# EAGLE design ws2812_Pentagon_V01 (EAGLE 7.7.0)
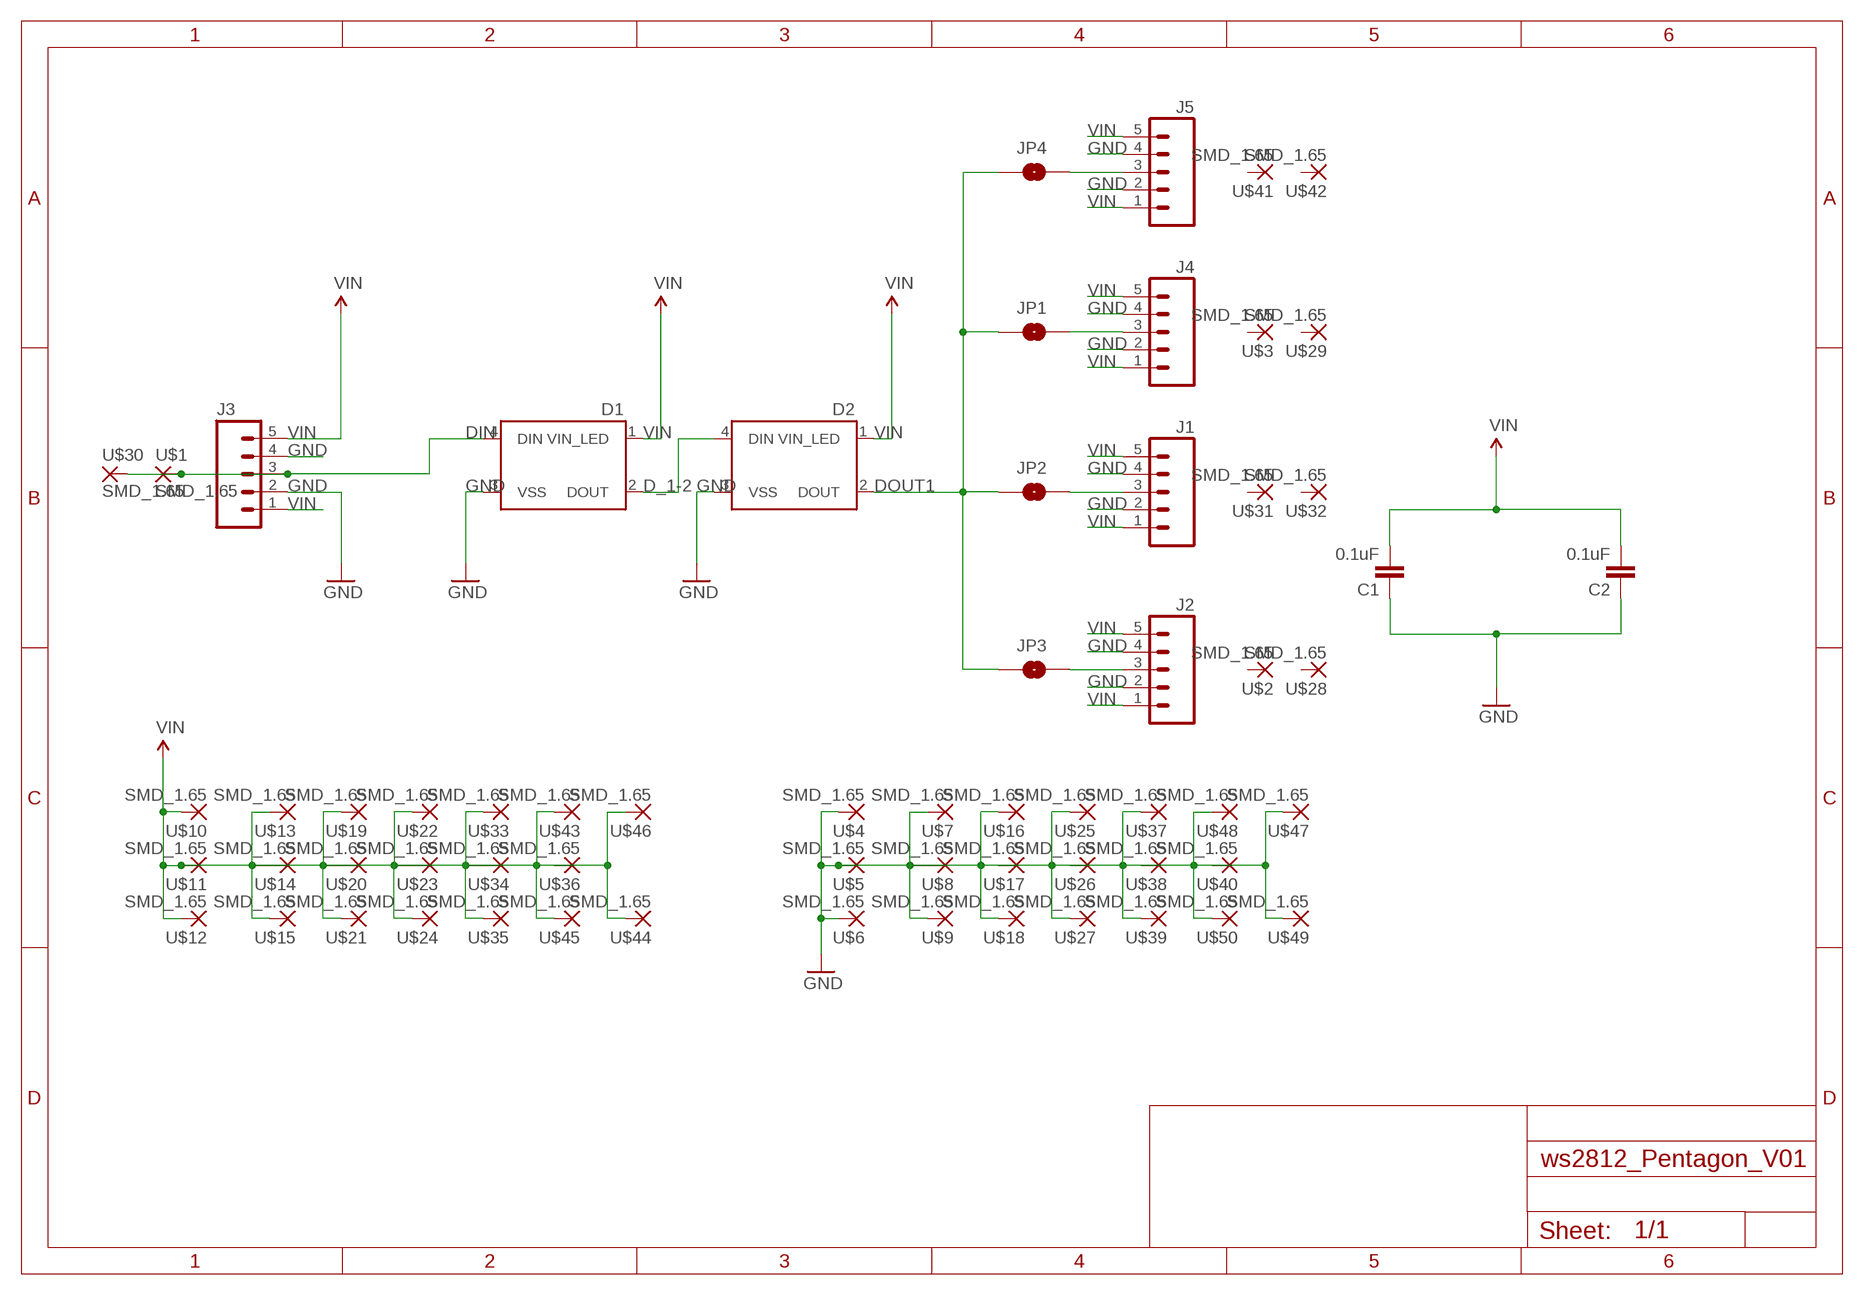
[diagram p0: schematic, sheet 1]

## Parts
C1  0.1uF  CAP0805  [0805]
C2  0.1uF  CAP0805  [0805]
D1  WS2812B  [WS2812B]
D2  WS2812B  [WS2812B]
J1  M05NO_SILK  [1X05_NO_SILK]
J2  M05NO_SILK  [1X05_NO_SILK]
J3  M05NO_SILK  [1X05_NO_SILK]
J4  M05NO_SILK  [1X05_NO_SILK]
J5  M05NO_SILK  [1X05_NO_SILK]
JP1  JUMPER-PAD-2-NOYES_SILK  [PAD-JUMPER-2-NO_YES_SILK]
JP2  JUMPER-PAD-2-NOYES_SILK  [PAD-JUMPER-2-NO_YES_SILK]
JP3  JUMPER-PAD-2-NOYES_SILK  [PAD-JUMPER-2-NO_YES_SILK]
JP4  JUMPER-PAD-2-NOYES_SILK  [PAD-JUMPER-2-NO_YES_SILK]
U$1  SMD_1.65  [SMD_PTH_1.65]
U$2  SMD_1.65  [SMD_PTH_1.65]
U$3  SMD_1.65  [SMD_PTH_1.65]
U$4  SMD_1.65  [SMD_PTH_1.65]
U$5  SMD_1.65  [SMD_PTH_1.65]
U$6  SMD_1.65  [SMD_PTH_1.65]
U$7  SMD_1.65  [SMD_PTH_1.65]
U$8  SMD_1.65  [SMD_PTH_1.65]
U$9  SMD_1.65  [SMD_PTH_1.65]
U$10  SMD_1.65  [SMD_PTH_1.65]
U$11  SMD_1.65  [SMD_PTH_1.65]
U$12  SMD_1.65  [SMD_PTH_1.65]
U$13  SMD_1.65  [SMD_PTH_1.65]
U$14  SMD_1.65  [SMD_PTH_1.65]
U$15  SMD_1.65  [SMD_PTH_1.65]
U$16  SMD_1.65  [SMD_PTH_1.65]
U$17  SMD_1.65  [SMD_PTH_1.65]
U$18  SMD_1.65  [SMD_PTH_1.65]
U$19  SMD_1.65  [SMD_PTH_1.65]
U$20  SMD_1.65  [SMD_PTH_1.65]
U$21  SMD_1.65  [SMD_PTH_1.65]
U$22  SMD_1.65  [SMD_PTH_1.65]
U$23  SMD_1.65  [SMD_PTH_1.65]
U$24  SMD_1.65  [SMD_PTH_1.65]
U$25  SMD_1.65  [SMD_PTH_1.65]
U$26  SMD_1.65  [SMD_PTH_1.65]
U$27  SMD_1.65  [SMD_PTH_1.65]
U$28  SMD_1.65  [SMD_PTH_1.65]
U$29  SMD_1.65  [SMD_PTH_1.65]
U$30  SMD_1.65  [SMD_PTH_1.65]
U$31  SMD_1.65  [SMD_PTH_1.65]
U$32  SMD_1.65  [SMD_PTH_1.65]
U$33  SMD_1.65  [SMD_PTH_1.65]
U$34  SMD_1.65  [SMD_PTH_1.65]
U$35  SMD_1.65  [SMD_PTH_1.65]
U$36  SMD_1.65  [SMD_PTH_1.65]
U$37  SMD_1.65  [SMD_PTH_1.65]
U$38  SMD_1.65  [SMD_PTH_1.65]
U$39  SMD_1.65  [SMD_PTH_1.65]
U$40  SMD_1.65  [SMD_PTH_1.65]
U$41  SMD_1.65  [SMD_PTH_1.65]
U$42  SMD_1.65  [SMD_PTH_1.65]
U$43  SMD_1.65  [SMD_PTH_1.65]
U$44  SMD_1.65  [SMD_PTH_1.65]
U$45  SMD_1.65  [SMD_PTH_1.65]
U$46  SMD_1.65  [SMD_PTH_1.65]
U$47  SMD_1.65  [SMD_PTH_1.65]
U$48  SMD_1.65  [SMD_PTH_1.65]
U$49  SMD_1.65  [SMD_PTH_1.65]
U$50  SMD_1.65  [SMD_PTH_1.65]

## Nets
D_1-2: D1.2(DOUT) D2.4(DIN)
DIN: D1.4(DIN) J3.3 U$1.P$1(P) U$30.P$1(P)
DOUT1: D2.2(DOUT) JP1.1 JP2.1 JP3.1 JP4.1
GND: C1.1 C2.1 D1.3(VSS) D2.3(VSS) J1.2 J1.4 J2.2 J2.4 J3.2 J3.4 J4.2 J4.4 J5.2 J5.4 U$4.P$1(P) U$5.P$1(P) U$6.P$1(P) U$7.P$1(P) U$8.P$1(P) U$9.P$1(P) U$16.P$1(P) U$17.P$1(P) U$18.P$1(P) U$25.P$1(P) U$26.P$1(P) U$27.P$1(P) U$37.P$1(P) U$38.P$1(P) U$39.P$1(P) U$40.P$1(P) U$47.P$1(P) U$48.P$1(P) U$49.P$1(P) U$50.P$1(P)
N$1: J4.3 JP1.2
N$2: J2.3 JP3.2
N$3: J1.3 JP2.2
N$4: J5.3 JP4.2
VIN: C1.2 C2.2 D1.1(VIN_LED) D2.1(VIN_LED) J1.1 J1.5 J2.1 J2.5 J3.1 J3.5 J4.1 J4.5 J5.1 J5.5 U$10.P$1(P) U$11.P$1(P) U$12.P$1(P) U$13.P$1(P) U$14.P$1(P) U$15.P$1(P) U$19.P$1(P) U$20.P$1(P) U$21.P$1(P) U$22.P$1(P) U$23.P$1(P) U$24.P$1(P) U$33.P$1(P) U$34.P$1(P) U$35.P$1(P) U$36.P$1(P) U$43.P$1(P) U$44.P$1(P) U$45.P$1(P) U$46.P$1(P)
Unconnected: U$2.P$1(P) U$3.P$1(P) U$28.P$1(P) U$29.P$1(P) U$31.P$1(P) U$32.P$1(P) U$41.P$1(P) U$42.P$1(P)

## Library data of the parts
C1 C2 = SparkFun-Capacitors:CAP: Capacitor Standard 0603 ceramic capacitor, and 0.1" leaded capacitor.
D1 D2 = SparkFun-LED:WS2812B: WS2812B - Intelligent control LED integrated light source Technical Specifications: Power Supply Voltage (VDD): 3.5 to 5.3 V Input Voltage (VI): -0.5 to VDD+0.5 V Operating Junction Temperature (Topt): -25°C to +80°C Storage Temperature Range (Tstg): -55°C to +150°C; PROD_ID: DIO-12503
J1-J5 = SparkFun-Connectors:M05: Header 5 Standard 5-pin 0.1" header. Use with straight break away headers (SKU : PRT-00116), right angle break away headers (PRT-00553), swiss pins (PRT-00743), machine pins (PRT-00117), and female headers (PRT-00115). Molex polarized connector foot print use with SKU : PRT-08230 with associated crimp pins and housings.
JP1-JP4 = SparkFun-Passives:JUMPER-PAD-2-NO
U$1-U$50 = Modified_wirepad:SMD_1.65

## Board
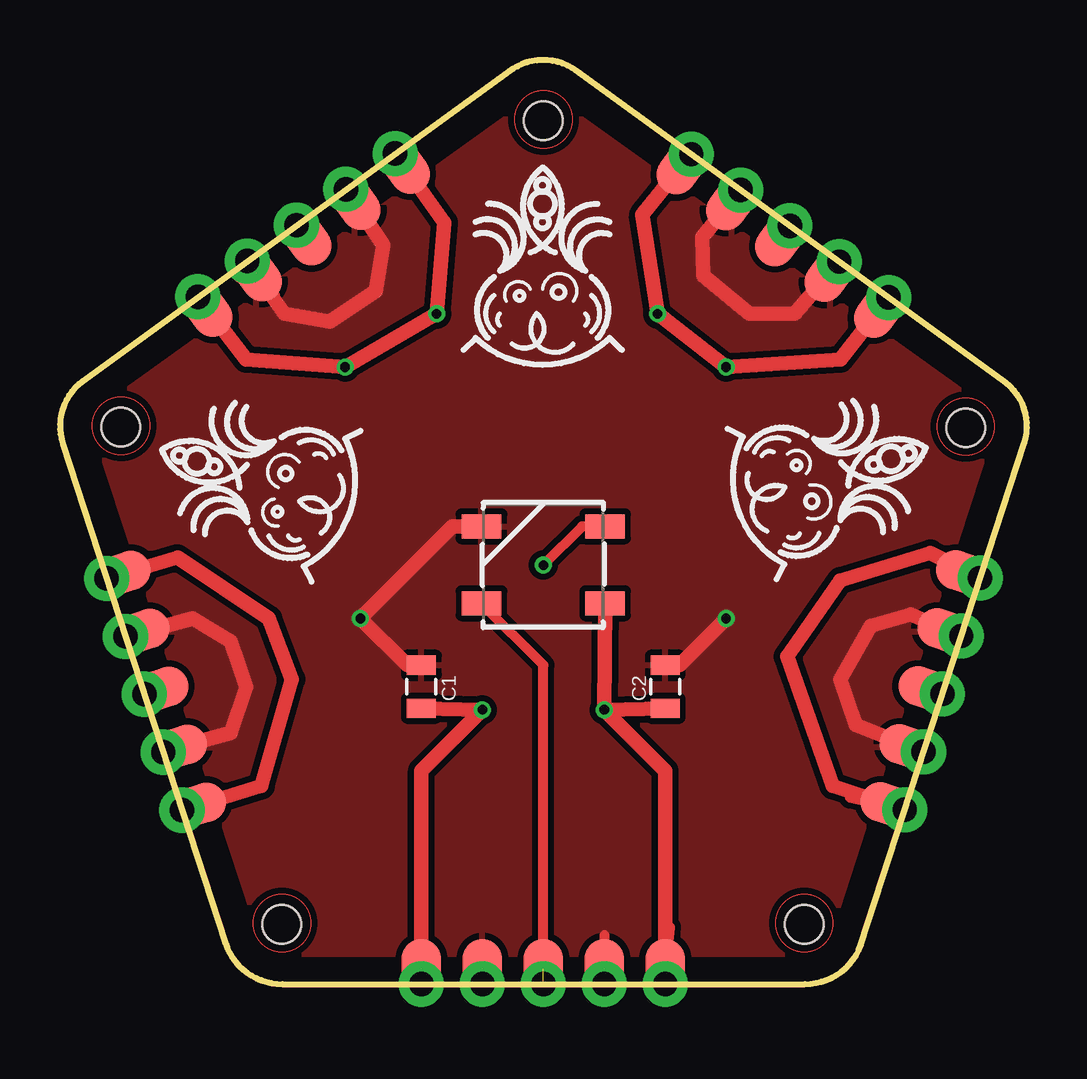
[diagram p1: board, top side]
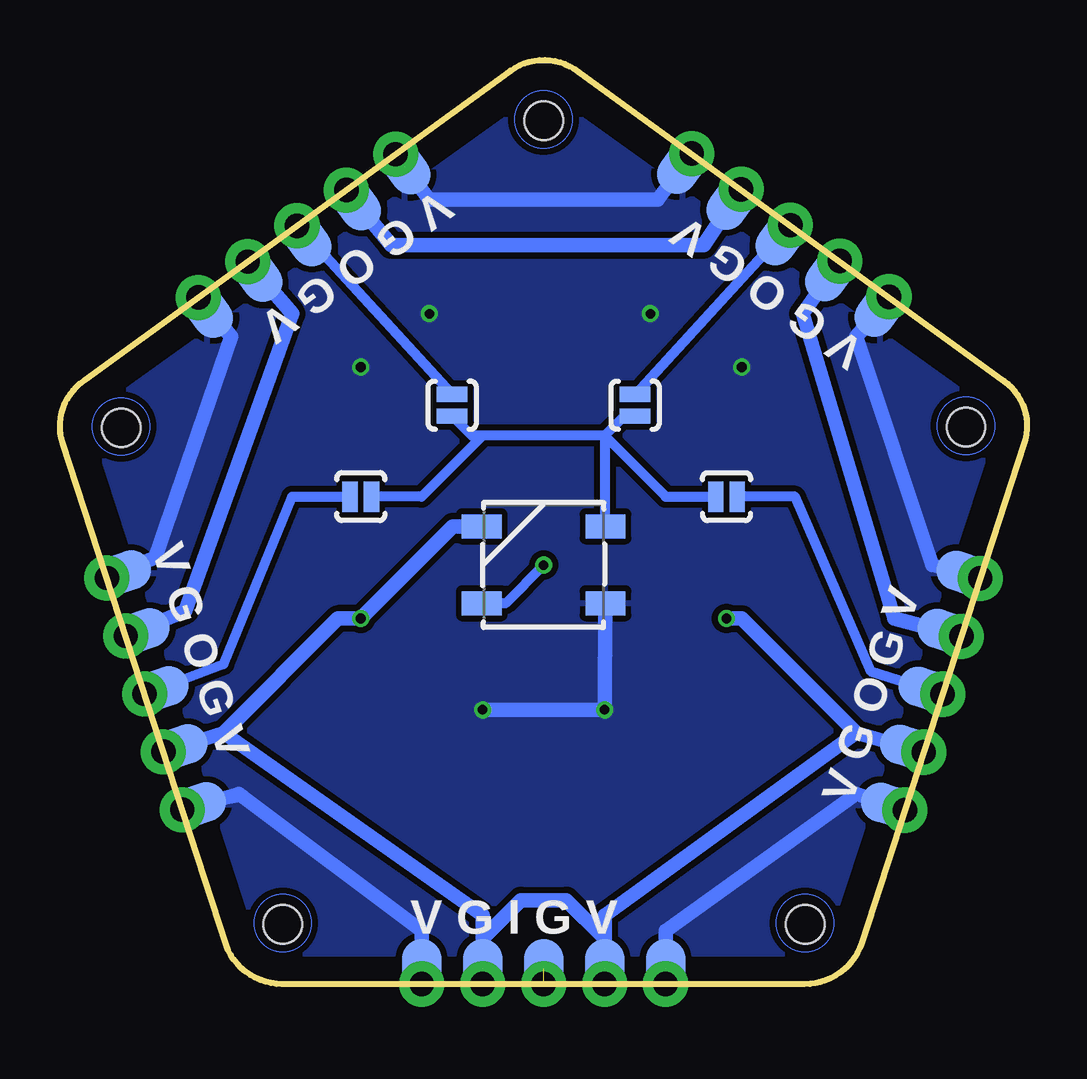
[diagram p2: board, bottom side, seen from below]

Size 40.29 x 38.52 mm. Coordinates in mm from the lower left corner, seen from the top.
Outline: 9.27,0 31.04,0 arc70 33.37,1.63 40.18,22.55 arc75 39.26,25.17 21.51,38.08 arc74 18.69,38.02 0.96,25.15 arc73 0.12,22.5 6.88,1.73 arc72 9.27,0
Copper layers (1*16): Top 0.035mm / dielectric 1.5mm / Bottom 0.035mm
Design rules "SeeedStudio_2layer_DRU_no_angle_20140221": minimum track width 6mil, minimum drill 12mil, track to track 6mil, track to pad 6mil, pad to pad 6mil, via to via 6mil, smd to smd 0mil, copper to edge 10mil, drill to drill 10mil, minimum pad ring 10mil, minimum via ring 6mil, stop-mask expansion 2mil, vias tented up to drill 100mil, thermal gap 10mil
Holes 1.6 mm at 9.24,2.49 31.01,2.49 37.74,23.19 2.54,23.22 20.14,35.99

### Footprints (pad centres in the part's own frame; a part is rotated, then mirrored left to right if it is on the bottom)
0805 = smd 0.8 x 1.2: 1 -0.9,0; 2 0.9,0
WS2812B = smd 1.651 x 1: 1 -2.577,1.6; 2 -2.577,-1.6; 3 2.577,-1.6; 4 2.577,1.6
1X05_NO_SILK = drill 1.016 pad 1.88: 1 0,0; 2 2.54,0; 3 5.08,0; 4 7.62,0; 5 10.16,0
PAD-JUMPER-2-NO_YES_SILK = smd 0.635 x 1.27: 1 -0.45,0; 2 0.45,0
SMD_PTH_1.65 = smd 1.65 x 2.5: P$1 0,0.635

### Placement (x,y rotation side)
C1  15.06,12.4 270 top
C2  25.22,12.4 270 top
D1  20.14,17.48 180 top
D2  20.14,17.48 180 bottom
J1  13.97,34.62 216 top
J2  1.95,16.91 288 top
J3  15.06,0 0 top
J4  35.2,7.26 72 top
J5  34.52,28.62 144 top
JP1  27.76,20.32 180 bottom
JP2  16.33,24.13 90 bottom
JP3  12.52,20.32 0 bottom
JP4  23.95,24.13 90 bottom
U$1  20.14,0 0 bottom
U$2  9.86,31.64 144 bottom
U$3  3.52,12.08 72 bottom
U$4  17.6,0 0 bottom
U$5  22.68,0 0 bottom
U$6  7.8,30.14 144 bottom
U$7  11.91,33.13 144 bottom
U$8  2.73,14.5 72 bottom
U$9  4.3,9.67 72 bottom
U$10  25.22,0 0 bottom
U$11  15.06,0 0 bottom
U$12  13.97,34.62 144 bottom
U$13  5.75,28.65 144 bottom
U$14  1.95,16.91 72 bottom
U$15  5.08,7.25 72 bottom
U$16  17.6,0 0 top
U$17  22.68,0 0 top
U$18  2.73,14.5 288 top
U$19  1.95,16.91 288 top
U$20  15.06,0 0 top
U$21  25.22,0 0 top
U$22  5.08,7.25 288 top
U$23  13.97,34.62 216 top
U$24  5.75,28.65 216 top
U$25  4.3,9.67 288 top
U$26  11.91,33.13 216 top
U$27  7.8,30.14 216 top
U$28  9.86,31.64 216 top
U$29  3.52,12.08 288 top
U$30  20.14,0 0 top
U$31  36.77,12.1 288 bottom
U$32  36.77,12.1 72 top
U$33  35.2,7.26 72 top
U$34  38.34,16.93 72 top
U$35  38.34,16.93 288 bottom
U$36  35.2,7.26 288 bottom
U$37  35.98,9.68 72 top
U$38  35.98,9.68 288 bottom
U$39  37.55,14.51 288 bottom
U$40  37.55,14.51 72 top
U$41  30.41,31.61 216 bottom
U$42  30.41,31.61 144 top
U$43  26.3,34.59 216 bottom
U$44  26.3,34.59 144 top
U$45  34.52,28.62 216 bottom
U$46  34.52,28.62 144 top
U$47  28.36,33.1 216 bottom
U$48  28.36,33.1 144 top
U$49  32.47,30.11 216 bottom
U$50  32.47,30.11 144 top

### Tracks (layer width: path | path; a pad name or v marks a point on that pad's centre or on a via)
D_1-2  (via drill 0.4)
  Top 0.406: D1.2 21.75,19.07 v20.14,17.46
  Bottom 0.406: v20.14,17.46 21.73,15.88 D2.4 | D2.4
DIN  (2 unrouted)
  Top 0.406: J3.3 20.14,13.3 D1.4
DOUT1
  Bottom 0.406: JP2.1 16.78,23.68 17.6,22.86 | 17.6,22.86 17.6,19.11 D2.2 | 17.6,22.86 15.06,20.32 JP3.1 | 17.6,22.86 22.68,22.86 | 22.68,22.86 23.13,22.86 JP4.1 | 22.68,22.86 25.22,20.32 JP1.1
GND  (via drill 0.4)  (5 unrouted)
  Top 0.406: U$17.P$1 J3.4 | U$17.P$1 22.68,1.78 | 22.68,2.03 U$17.P$1 | U$27.P$1 8.45,28.96 U$27.P$1 | U$27.P$1 7.95,29.97 | 7.95,29.97 7.95,30.23 8.96,28.7 7.69,30.23 | 7.69,30.23 8.71,28.7 7.95,29.97 | 7.95,29.97 7.69,30.23 | 7.69,30.23 7.69,29.97 7.44,29.46 U$27.P$1 | U$26.P$1 12.52,32 12.01,33.02 12.26,32
  Top 0.61: C1.1 14.46,13.29 v12.52,15.24 16.35,19.07 D1.3 | C2.1 25.81,13.29 v27.76,15.24 | U$25.P$1 7.12,10.48 7.76,12.38 7.12,14.29 5.53,15.24 J2.2 | J4.2 33.16,10.79 32.52,12.7 33.79,14.92 35.44,15.4 J4.4 | J5.2 30.62,27.94 28.71,27.94 26.81,29.53 26.77,31.14 J5.4 | J1.4 9.34,27.94 11.25,27.62 13.15,28.89 13.47,30.8 J1.2
  Bottom 0.406: U$47.P$1 27.46,32.59 27.46,31.99 | U$49.P$1 31.64,29.6 31.64,29.15 | U$40.P$1 | U$40.P$1 37.55,14.71 J4.4 | U$38.P$1 | U$38.P$1 J4.2
  Bottom 0.61: J3.2 17.6,1.91 | 17.6,1.91 17.6,2.86 7.12,10.48 | 7.12,10.48 J2.4 U$25.P$1 | 17.6,1.91 19.19,3.49 21.09,3.49 22.68,1.91 J3.4 22.68,2.86 33.47,10.48 | 33.47,10.48 J4.2 | J4.4 35.06,15.56 30.62,27.94 31.64,29.15 J5.2 | J5.4 27.46,31.99 26.49,30.8 13.47,30.8 J1.2 | J1.4 9.34,27.94 5.53,15.24 J2.2 | v12.52,15.24 11.88,15.24 7.12,10.48 | 33.47,10.48 28.71,15.24 v27.76,15.24 23.92,19.07 D2.3 | U$25.P$1
  pour Top (isolate 0.254): 9.34,1.27 30.93,1.27 32.2,2.54 38.55,22.23 37.92,24.45 21.09,36.51 19.19,36.51 2.36,24.45 1.72,22.23 8.07,2.86
N$1
  Bottom 0.406: J4.3 33.47,13.34 30.62,20.32 JP1.2
N$2
  Bottom 0.406: J2.3 6.49,13.02 9.66,20.32 JP3.2
N$3
  Bottom 0.406: JP2.2 J1.3
N$4
  Bottom 0.406: JP4.2 J5.3
VIN  (via drill 0.4)  (6 unrouted)
  Top 0.406: U$23.P$1 13.97,34.11 J1.1 | U$36.P$1 32.92,7.78 J4.1 | 25.41,2.37 25.32,1.57 U$21.P$1 25.73,0.76 | U$24.P$1 6.47,27.73 J1.5
  Top 0.61: C1.2 v17.6,11.43 15.06,8.89 J3.1 | D1.1 v22.68,11.43 | v22.68,11.43 C2.2 | J3.5 U$21.P$1 25.22,8.89 v22.68,11.43 | J2.5 8.39,8.26 9.66,12.7 8.71,15.24 4.9,17.78 J2.1 | J4.1 32.2,8.26 30.3,13.65 32.52,16.83 36.26,17.98 J4.5 | J5.1 32.52,26.04 v27.76,25.72 v24.9,27.94 24.27,32.07 J5.5 | J1.1 16.01,31.75 v15.69,27.94 v11.88,25.72 7.76,26.04 J1.5
  Bottom 0.406: J5.1 34.15,28.62 U$46.P$1 | U$46.P$1 | U$46.P$1 34.11,28.11 34.11,27.94 34.15,27.94 U$46.P$1 | U$35.P$1 | U$35.P$1 37.92,17.12 37.92,16.51 37.73,16.51 U$35.P$1 | U$36.P$1 33.6,7.62 35.12,7.37 32.69,7.82 | U$44.P$1 26.49,34.08 26.49,34.29 25.93,34.29 U$44.P$1
  Bottom 0.61: J3.1 15.06,2.22 7.12,7.94 J2.5 | J3.5 25.22,2.22 32.69,7.82 32.84,7.94 J4.1 | J4.5 36.33,17.78 33.16,26.99 J5.1 | J5.5 24.9,32.7 15.38,32.7 J1.1 | U$24.P$1 7.12,26.99 3.95,17.46 J2.1 | D2.1 v17.6,11.43 v22.68,11.43
  pour Bottom (isolate 0.254): 9.34,1.27 30.93,1.27 32.2,2.54 38.55,22.23 37.92,24.45 21.09,36.51 19.19,36.51 2.36,24.45 1.72,22.23 8.07,2.86
(copper drawn outside any net)
  shapes: Bottom circle x5, Top circle x5

### Text on the board
bPlace: V G O G V | V G O G V | V G O G V | V G O G V | V G I G V